# EAGLE design ESP12-breakout-pth-rev1 (EAGLE 7.4.0)
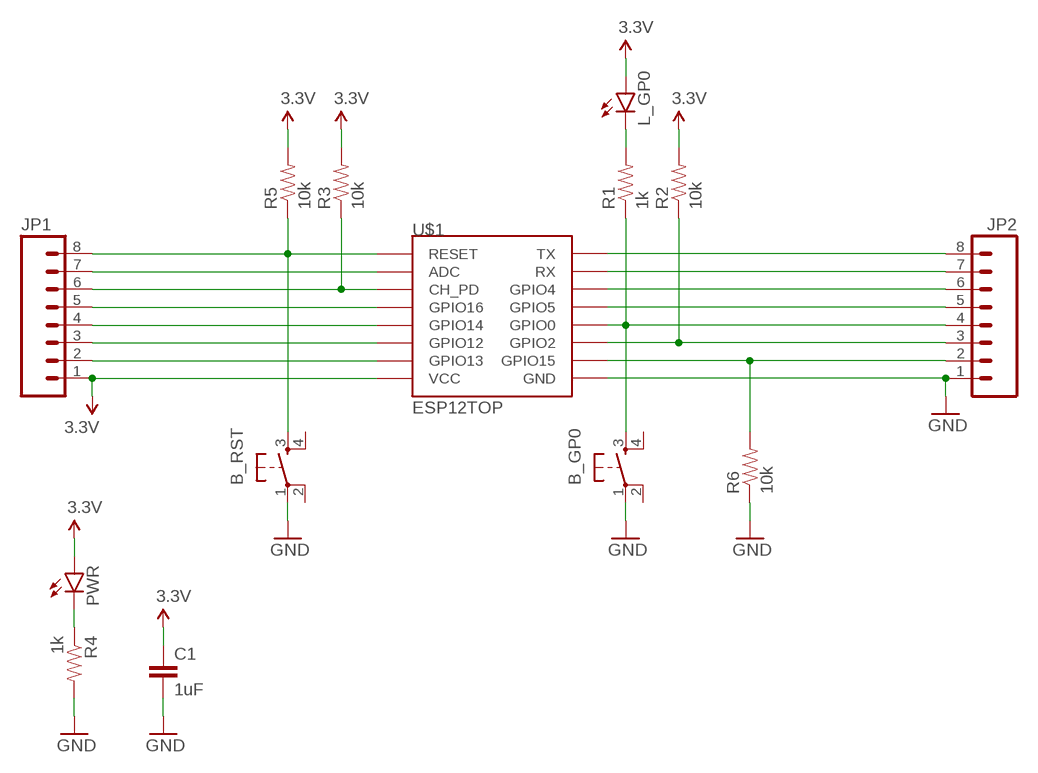
[diagram p0: schematic, sheet 1]

## Parts
B_GP0  TAC_SWITCHPTH  [TACTILE-PTH]
B_RST  TAC_SWITCHPTH  [TACTILE-PTH]
C1  1uF  CAPPTH  [CAP-PTH-SMALL]
JP1  M08  [1X08_PIN1_NO_SILK]
JP2  M08  [1X08_PIN1_NO_SILK]
L_GP0  LED3MM  [LED3MM]
PWR  LED3MM  [LED3MM]
R1  1k  RESISTORPTH-1/6W  [1/6W-RES]
R2  10k  RESISTORPTH-1/6W  [1/6W-RES]
R3  10k  RESISTORPTH-1/6W  [1/6W-RES]
R4  1k  RESISTORPTH-1/6W  [1/6W-RES]
R5  10k  RESISTORPTH-1/6W  [1/6W-RES]
R6  10k  RESISTORPTH-1/6W  [1/6W-RES]
U$1  ESP12TOP  [ESP12TOP]

## Nets
3.3V: C1.1 JP1.1 L_GP0.A PWR.A R2.2 R3.2 R5.2 U$1.VCC
GND: B_GP0.1 B_RST.1 C1.2 JP2.1 R4.2 R6.1 U$1.GND
N$1: L_GP0.K(C) R1.2
N$2: JP1.2 U$1.GPIO13
N$3: JP1.3 U$1.GPIO12
N$4: JP1.4 U$1.GPIO14
N$5: JP1.5 U$1.GPIO16
N$6: JP1.6 R3.1 U$1.CH_PD
N$7: JP1.7 U$1.ADC
N$8: B_RST.3 JP1.8 R5.1 U$1.RESET
N$9: PWR.K(C) R4.1
N$10: JP2.2 R6.2 U$1.GPIO15
N$11: JP2.3 R2.1 U$1.GPIO2
N$12: B_GP0.3 JP2.4 R1.1 U$1.GPIO0
N$13: JP2.5 U$1.GPIO5
N$14: JP2.6 U$1.GPIO4
N$15: JP2.7 U$1.RXD(RX)
N$16: JP2.8 U$1.TXD(TX)
Unconnected: B_GP0.2 B_GP0.4 B_RST.2 B_RST.4

## Library data of the parts
B_GP0 B_RST = SparkFun-Electromechanical:TAC_SWITCH: Momentary Switch Button commonly used for reset or general input. Spark Fun Electronics SKU : COM-00097 SMT- SWCH-08247
C1 = SparkFun-Capacitors:CAP: Capacitor Standard 0603 ceramic capacitor, and 0.1" leaded capacitor.
JP1 JP2 = SparkFun-Connectors:M08: Header 8 Standard 8-pin 0.1" header. Use with straight break away headers (SKU : PRT-00116), right angle break away headers (PRT-00553), swiss pins (PRT-00743), machine pins (PRT-00117), and female headers (PRT-00115).
L_GP0 PWR = SparkFun-LED:LED: LEDs Standard schematic elements and footprints for 5mm, 3mm, 1206, and 0603 sized LEDs. 5mm - Spark Fun Electronics SKU : COM-00529 (and others)
R1-R6 = SparkFun-Resistors:RESISTOR: Resistor Basic schematic elements and footprints for 0603, 1206, and PTH resistors.
U$1 = esp8266modules:ESP12: ESP8266 Wifi module 12

## Board
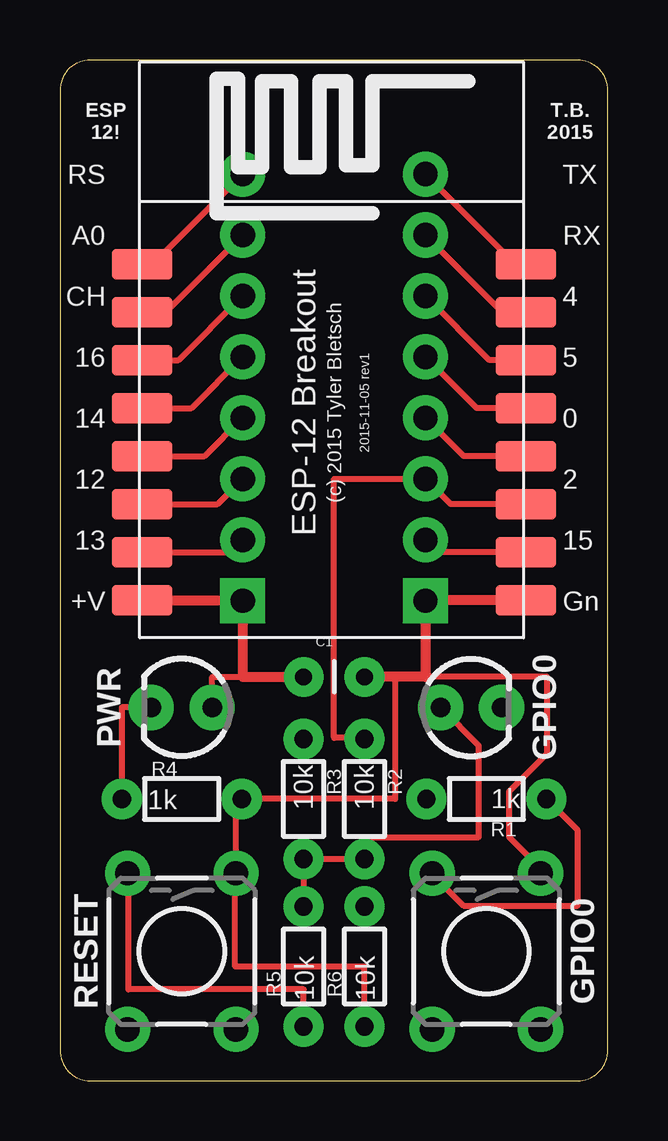
[diagram p1: board, top side]
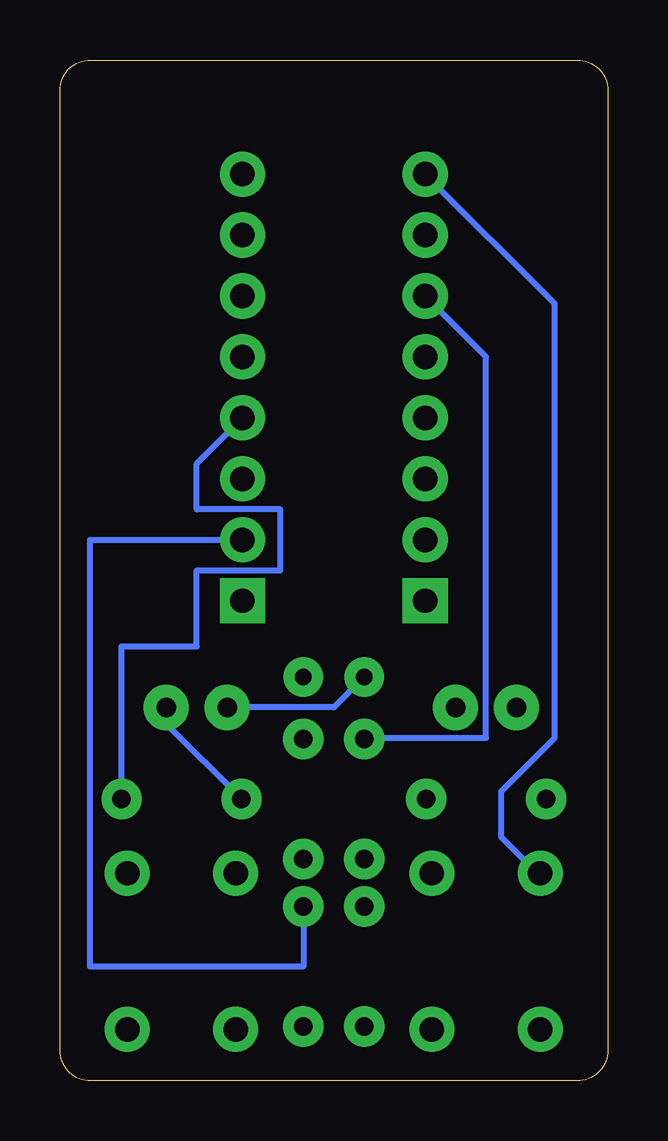
[diagram p2: board, bottom side, seen from below]

Size 22.85 x 42.53 mm. Coordinates in mm from the lower left corner, seen from the top.
Outline: 0,41.27 0,1.27 arc90 1.27,0 21.58,0 arc90 22.85,1.27 22.85,41.27 arc90 21.58,42.53 1.27,42.53 arc90 0,41.27
Copper layers (1*16): Top 0.035mm / dielectric 1.5mm / Bottom 0.035mm
Design rules "default": minimum track width 10mil, minimum drill 0.6mm, track to track 8mil, track to pad 8mil, pad to pad 8mil, via to via 8mil, smd to smd 8mil, copper to edge 40mil, drill to drill 8mil, minimum pad ring 10mil, minimum via ring 8mil, stop-mask expansion 4mil, vias tented up to drill 0mil, thermal gap 10mil

### Footprints (pad centres in the part's own frame; a part is rotated, then mirrored left to right if it is on the bottom)
TACTILE-PTH = drill 1.016 pad 1.88: 1 -3.251,2.261; 2 3.251,2.261; 3 -3.251,-2.261; 4 3.251,-2.261
CAP-PTH-SMALL = drill 0.7 pad 1.651: 1 0,0; 2 2.54,0
1X08_PIN1_NO_SILK = drill 1.016 pad 1.88 square: 1 0,0 | drill 1.016 pad 1.88: 2 2.54,0; 3 5.08,0; 4 7.62,0; 5 10.16,0; 6 12.7,0; 7 15.24,0; 8 17.78,0
LED3MM = drill 0.813 pad 1.88: A -1.27,0; K 1.27,0
1/6W-RES = drill 0.762 pad 1.676: 1 -2.5,0; 2 2.5,0
ESP12TOP = smd 2.54 x 1.27: ADC -8,3.77; CH_PD -8,1.77; GND 8,-8.23; GPIO0 8,-2.23; GPIO2 8,-4.23; GPIO4 8,1.77; GPIO5 8,-0.23; GPIO12 -8,-4.23; GPIO13 -8,-6.23; GPIO14 -8,-2.23; GPIO15 8,-6.23; GPIO16 -8,-0.23; RESET -8,5.77; RXD 8,3.77; TXD 8,5.77; VCC -8,-8.23

### Placement (x,y rotation side)
B_GP0  17.78,5.4 270 top
B_RST  5.08,5.4 270 top
C1  10.16,16.83 0 top
JP1  7.62,20 90 top
JP2  15.24,20 90 top
L_GP0  17.14,15.56 0 top
PWR  5.08,15.56 180 top
R1  17.78,11.75 180 top
R2  12.7,11.75 270 top
R3  10.16,11.75 270 top
R4  5.08,11.75 0 top
R5  10.16,4.76 90 top
R6  12.7,4.76 90 top
U$1  11.43,28.26 0 top

### Tracks (layer width: path | path; a pad name or v marks a point on that pad's centre or on a via)
3.3V
  Top 0.254: PWR.A 6.35,16.83 7.62,16.83 | L_GP0.A 17.46,13.97 17.46,10.16 12.7,10.16 R2.2 R3.2 R5.2
  Top 0.406: U$1.VCC 7.59,20.03 JP1.1 7.62,16.83 C1.1
  Bottom 0.254: C1.1 11.43,15.56 L_GP0.A
GND
  Top 0.254: 13.97,16.83 13.97,11.75 R4.2 7.34,11.51 B_RST.1 7.3,8.61 7.3,4.76 12.7,4.76 R6.1 | B_GP0.1 20.04,8.85 18.73,10.16 18.73,12.07 20.32,13.65 20.32,16.83 C1.2
  Top 0.406: U$1.GND 15.26,20.03 JP2.1 15.24,16.83 13.97,16.83 C1.2
N$1
  Bottom 0.254: L_GP0.K 18.42,14.88 R1.2
N$2
  Top 0.254: U$1.GPIO13 7.1,22.03 JP1.2
N$3
  Top 0.254: U$1.GPIO12 6.56,24.03 JP1.3
N$4
  Top 0.254: U$1.GPIO14 6.03,26.03 JP1.4
N$5
  Top 0.254: U$1.GPIO16 5.48,28.03 JP1.5
N$6
  Top 0.254: U$1.CH_PD 4.95,30.03 JP1.6
  Bottom 0.254: R3.1 10.16,14.29 5.08,14.29 5.08,30.16 JP1.6
N$7
  Top 0.254: U$1.ADC 4.4,32.03 JP1.7
N$8
  Top 0.254: U$1.RESET 3.86,34.03 JP1.8 | R5.1 10.16,3.81 2.86,3.81 2.86,8.65 B_RST.3
  Bottom 0.254: B_RST.3 2.93,8.65 4.45,10.16 4.45,12.07 2.22,14.29 2.22,32.38 JP1.8
N$9
  Top 0.254: PWR.K 2.58,15.56 R4.1
N$10
  Top 0.254: U$1.GPIO15 15.76,22.03 JP2.2
  Bottom 0.254: R6.2 12.7,4.76 21.59,4.76 21.59,22.54 JP2.2
N$11
  Top 0.254: U$1.GPIO2 16.3,24.03 JP2.3 11.43,25.08 11.43,14.29 12.7,14.29 R2.1
N$12
  Top 0.254: U$1.GPIO0 16.84,26.03 JP2.4 | B_GP0.3 15.52,8.61 16.83,7.3 21.59,7.3 21.59,10.44 R1.1
  Bottom 0.254: R1.1 20.28,18.1 17.14,18.1 17.14,21.27 13.65,21.27 13.65,23.81 17.14,23.81 17.14,25.72 JP2.4
N$13
  Top 0.254: U$1.GPIO5 17.38,28.03 JP2.5
N$14
  Top 0.254: U$1.GPIO4 17.92,30.03 JP2.6
N$15
  Top 0.254: U$1.RXD 18.46,32.03 JP2.7
N$16
  Top 0.254: U$1.TXD 19,34.03 JP2.8

### Text on the board
tPlace: ESP / 12! | T.B. / 2015 | RS | TX | A0 | RX | CH | 4 | 16 | 5 | 14 | ESP-12 Breakout | (c) 2015 Tyler Bletsch | 2015-11-05 rev1 | 0 | 12 | 2 | 13 | 15 | +V | Gn | PWR | GPIO0 | RESET | GPIO0